# Altium project LEDMatrix.PrjPcb
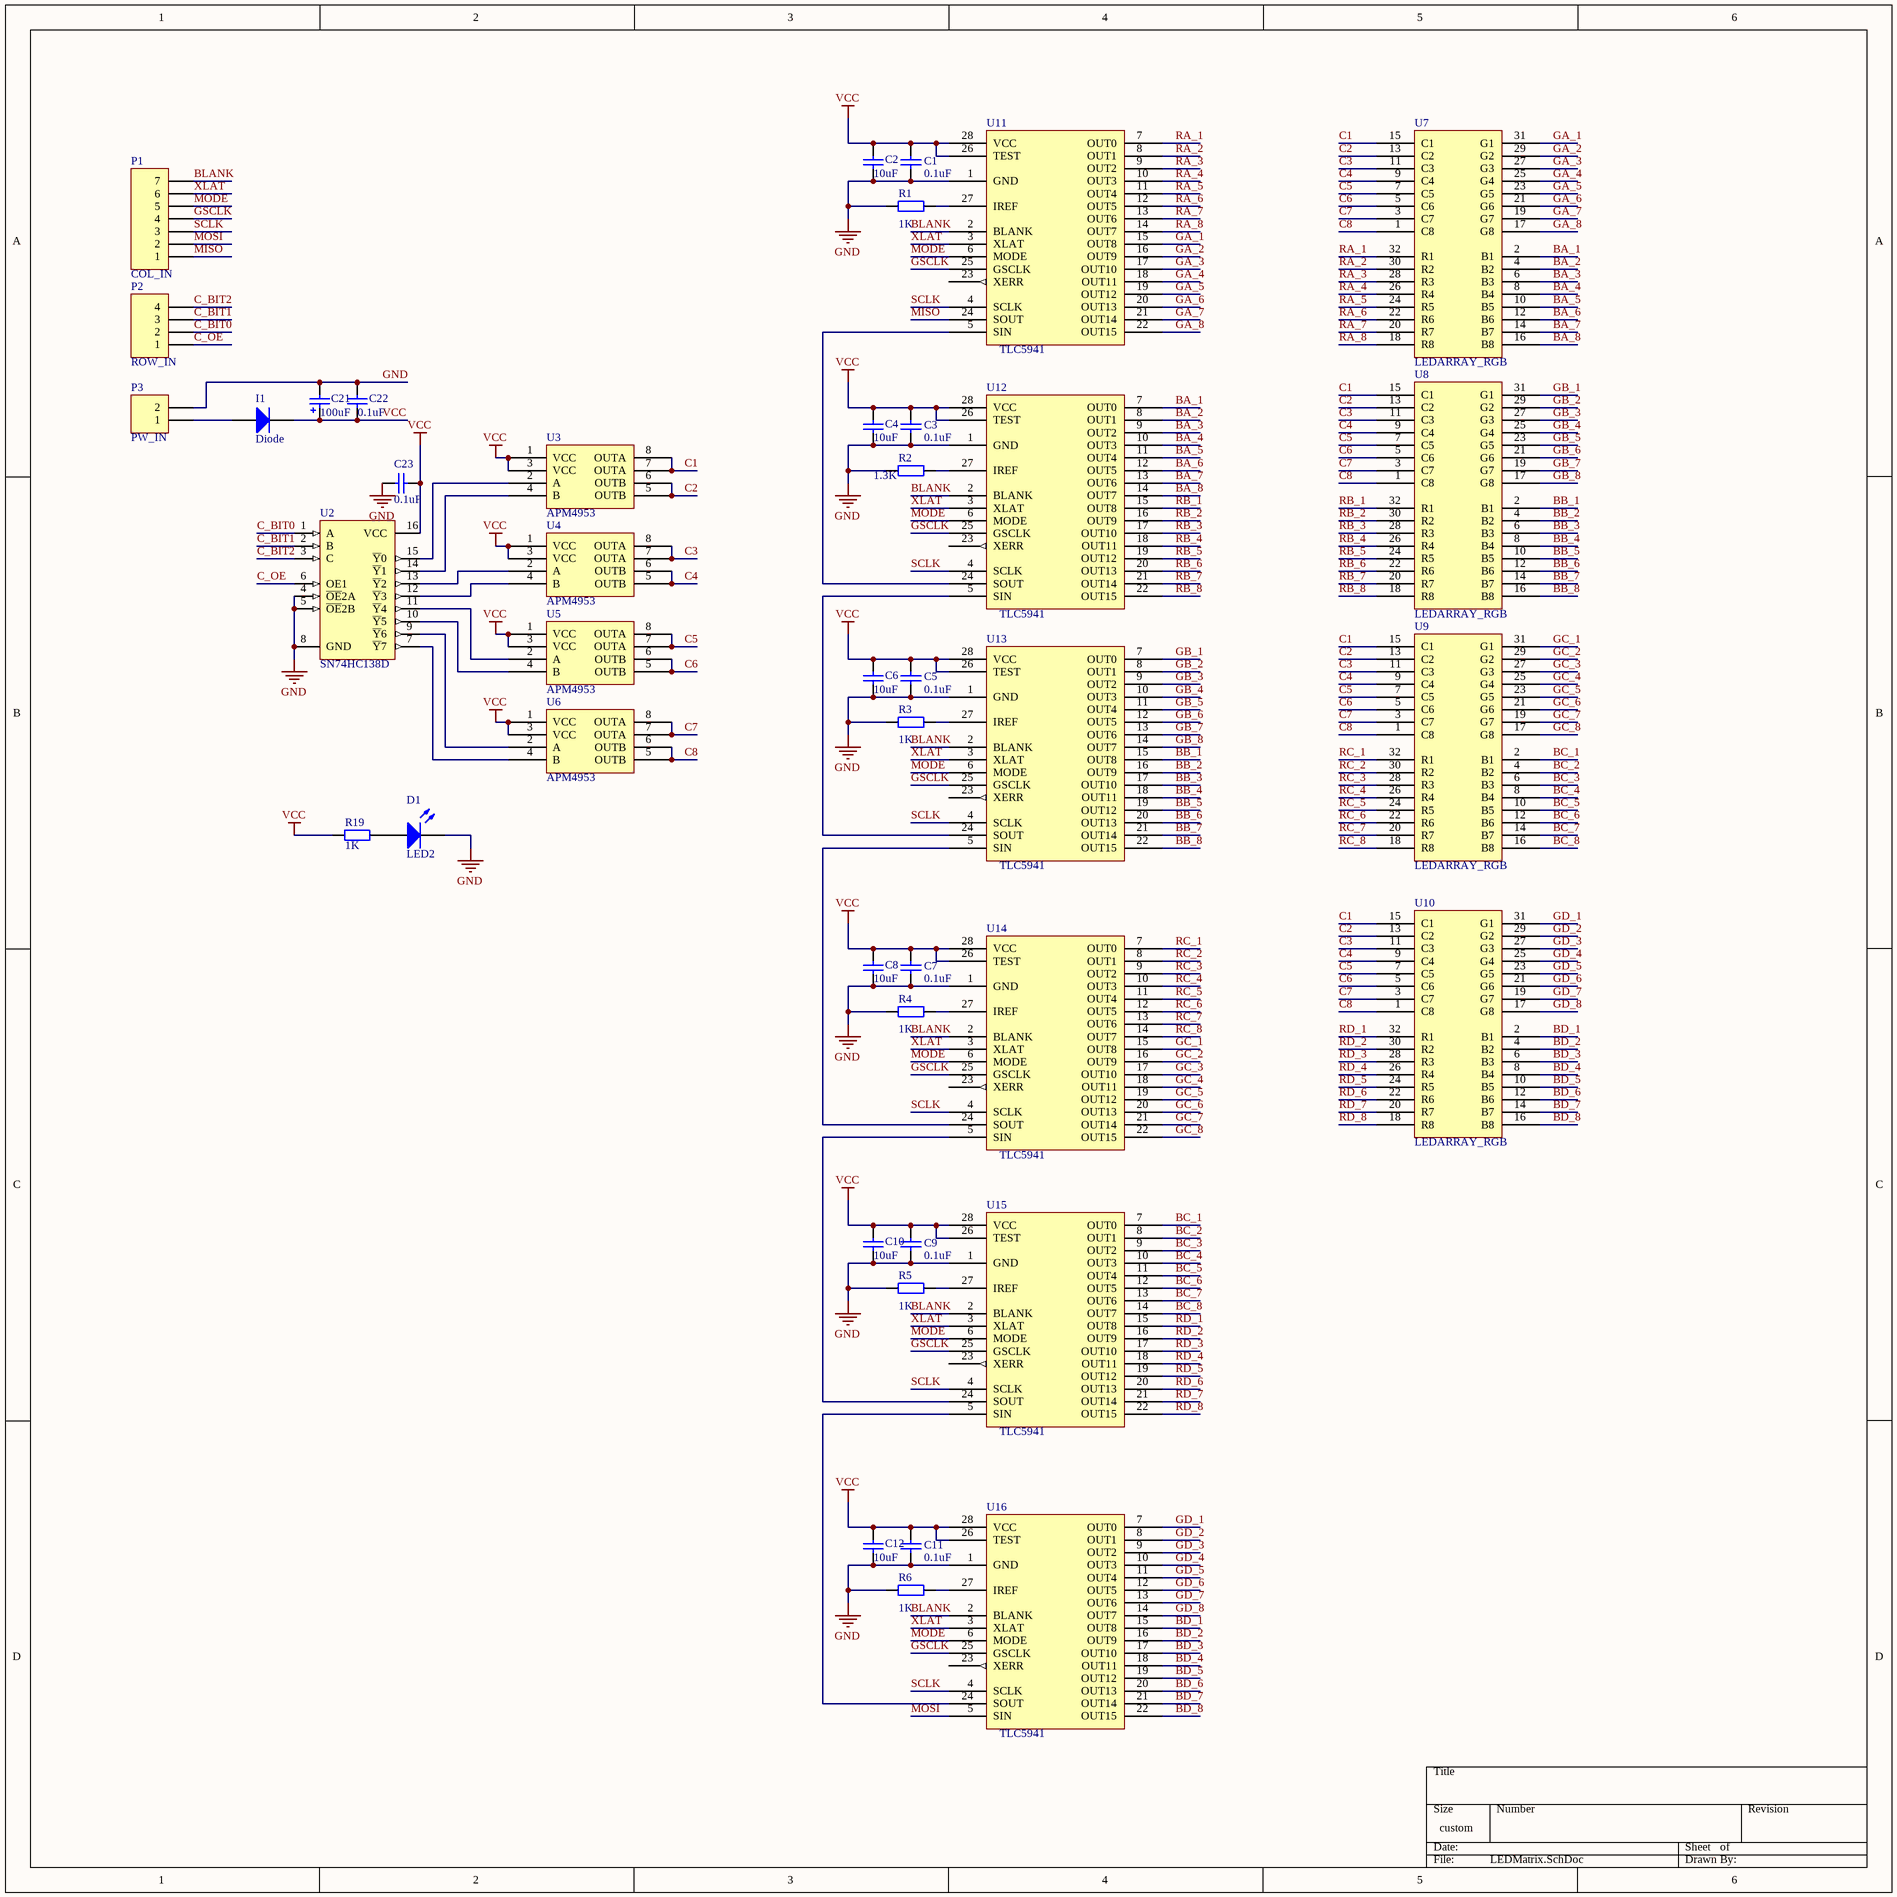
[diagram p0: LEDMatrix.SchDoc]
1 sheet, 42 parts. Net scope: global (net labels, ports and power ports of the same name join across sheets).
Board file: LEDMatrix.PcbDoc

## Sheet LEDMatrix.SchDoc
size 381 x 381 mm

### Parts
C1  value 0.1uF  [C-0805]  (hidden comment: Cap)
C2  value 10uF  [C-0805]  (hidden comment: Cap)
C3  value 0.1uF  [C-0805]  (hidden comment: Cap)
C4  value 10uF  [C-0805]  (hidden comment: Cap)
C5  value 0.1uF  [C-0805]  (hidden comment: Cap)
C6  value 10uF  [C-0805]  (hidden comment: Cap)
C7  value 0.1uF  [C-0805]  (hidden comment: Cap)
C8  value 10uF  [C-0805]  (hidden comment: Cap)
C9  value 0.1uF  [C-0805]  (hidden comment: Cap)
C10  value 10uF  [C-0805]  (hidden comment: Cap)
C11  value 0.1uF  [C-0805]  (hidden comment: Cap)
C12  value 10uF  [C-0805]  (hidden comment: Cap)
C21  value 100uF  [CAPAE-D]  (hidden comment: Cap Pol2)
C22  value 0.1uF  [C-0805]  (hidden comment: Cap)
C23  value 0.1uF  [C-0805]  (hidden comment: Cap)
D1  LED2  [LED-0805]
I1  Diode  [D-SMA]
P1  COL_IN  [HDR1X7]
P2  ROW_IN  [HDR1X4]
P3  PW_IN  [HDR1X2]
R1  value 1K  [0805-1]  (hidden comment: Res2)
R2  value 1.3K  [0805-1]  (hidden comment: Res2)
R3  value 1K  [0805-1]  (hidden comment: Res2)
R4  value 1K  [0805-1]  (hidden comment: Res2)
R5  value 1K  [0805-1]  (hidden comment: Res2)
R6  value 1K  [0805-1]  (hidden comment: Res2)
R19  value 1K  [0805-1]  (hidden comment: Res2)
U2  SN74HC138D  [SOIC-16]
U3  APM4953  [SOIC-8]
U4  APM4953  [SOIC-8]
U5  APM4953  [SOIC-8]
U6  APM4953  [SOIC-8]
U7  LEDARRAY_RGB  [DIP32]
U8  LEDARRAY_RGB  [DIP32]
U9  LEDARRAY_RGB  [DIP32]
U10  LEDARRAY_RGB  [DIP32]
U11  TLC5941  [TSOP28_N]
U12  TLC5941  [TSOP28_N]
U13  TLC5941  [TSOP28_N]
U14  TLC5941  [TSOP28_N]
U15  TLC5941  [TSOP28_N]
U16  TLC5941  [TSOP28_N]

### Nets
GND: C1.1 C2.1 C3.1 C4.1 C5.1 C6.1 C7.1 C8.1 C9.1 C10.1 C11.1 C12.1 C21.2 C22.2 C23.2 D1.2(K) P3.2 R1.1 R2.1 R3.1 R4.1 R5.1 R6.1 U2.4(~{OE}2A) U2.5(~{OE}2B) U2.8(GND) U11.1(GND) U12.1(GND) U13.1(GND) U14.1(GND) U15.1(GND) U16.1(GND)
VCC: C1.2 C2.2 C3.2 C4.2 C5.2 C6.2 C7.2 C8.2 C9.2 C10.2 C11.2 C12.2 C21.1 C22.1 C23.1 I1.2(K) R19.2 U2.16(VCC) U3.1(VCC) U3.3(VCC) U4.1(VCC) U4.3(VCC) U5.1(VCC) U5.3(VCC) U6.1(VCC) U6.3(VCC) U11.26(TEST) U11.28(VCC) U12.26(TEST) U12.28(VCC) U13.26(TEST) U13.28(VCC) U14.26(TEST) U14.28(VCC) U15.26(TEST) U15.28(VCC) U16.26(TEST) U16.28(VCC)
BA_1: U7.2(B1) U12.7(OUT0)
BA_2: U7.4(B2) U12.8(OUT1)
BA_3: U7.6(B3) U12.9(OUT2)
BA_4: U7.8(B4) U12.10(OUT3)
BA_5: U7.10(B5) U12.11(OUT4)
BA_6: U7.12(B6) U12.12(OUT5)
BA_7: U7.14(B7) U12.13(OUT6)
BA_8: U7.16(B8) U12.14(OUT7)
BB_1: U8.2(B1) U13.15(OUT8)
BB_2: U8.4(B2) U13.16(OUT9)
BB_3: U8.6(B3) U13.17(OUT10)
BB_4: U8.8(B4) U13.18(OUT11)
BB_5: U8.10(B5) U13.19(OUT12)
BB_6: U8.12(B6) U13.20(OUT13)
BB_7: U8.14(B7) U13.21(OUT14)
BB_8: U8.16(B8) U13.22(OUT15)
BC_1: U9.2(B1) U15.7(OUT0)
BC_2: U9.4(B2) U15.8(OUT1)
BC_3: U9.6(B3) U15.9(OUT2)
BC_4: U9.8(B4) U15.10(OUT3)
BC_5: U9.10(B5) U15.11(OUT4)
BC_6: U9.12(B6) U15.12(OUT5)
BC_7: U9.14(B7) U15.13(OUT6)
BC_8: U9.16(B8) U15.14(OUT7)
BD_1: U10.2(B1) U16.15(OUT8)
BD_2: U10.4(B2) U16.16(OUT9)
BD_3: U10.6(B3) U16.17(OUT10)
BD_4: U10.8(B4) U16.18(OUT11)
BD_5: U10.10(B5) U16.19(OUT12)
BD_6: U10.12(B6) U16.20(OUT13)
BD_7: U10.14(B7) U16.21(OUT14)
BD_8: U10.16(B8) U16.22(OUT15)
BLANK: P1.7 U11.2(BLANK) U12.2(BLANK) U13.2(BLANK) U14.2(BLANK) U15.2(BLANK) U16.2(BLANK)
C1: U3.7(OUTA) U3.8(OUTA) U7.15(C1) U8.15(C1) U9.15(C1) U10.15(C1)
C2: U3.5(OUTB) U3.6(OUTB) U7.13(C2) U8.13(C2) U9.13(C2) U10.13(C2)
C3: U4.7(OUTA) U4.8(OUTA) U7.11(C3) U8.11(C3) U9.11(C3) U10.11(C3)
C4: U4.5(OUTB) U4.6(OUTB) U7.9(C4) U8.9(C4) U9.9(C4) U10.9(C4)
C5: U5.7(OUTA) U5.8(OUTA) U7.7(C5) U8.7(C5) U9.7(C5) U10.7(C5)
C6: U5.5(OUTB) U5.6(OUTB) U7.5(C6) U8.5(C6) U9.5(C6) U10.5(C6)
C7: U6.7(OUTA) U6.8(OUTA) U7.3(C7) U8.3(C7) U9.3(C7) U10.3(C7)
C8: U6.5(OUTB) U6.6(OUTB) U7.1(C8) U8.1(C8) U9.1(C8) U10.1(C8)
C_BIT0: P2.2 U2.1(A)
C_BIT1: P2.3 U2.2(B)
C_BIT2: P2.4 U2.3(C)
C_OE: P2.1 U2.6(OE1)
GA_1: U7.31(G1) U11.15(OUT8)
GA_2: U7.29(G2) U11.16(OUT9)
GA_3: U7.27(G3) U11.17(OUT10)
GA_4: U7.25(G4) U11.18(OUT11)
GA_5: U7.23(G5) U11.19(OUT12)
GA_6: U7.21(G6) U11.20(OUT13)
GA_7: U7.19(G7) U11.21(OUT14)
GA_8: U7.17(G8) U11.22(OUT15)
GB_1: U8.31(G1) U13.7(OUT0)
GB_2: U8.29(G2) U13.8(OUT1)
GB_3: U8.27(G3) U13.9(OUT2)
GB_4: U8.25(G4) U13.10(OUT3)
GB_5: U8.23(G5) U13.11(OUT4)
GB_6: U8.21(G6) U13.12(OUT5)
GB_7: U8.19(G7) U13.13(OUT6)
GB_8: U8.17(G8) U13.14(OUT7)
GC_1: U9.31(G1) U14.15(OUT8)
GC_2: U9.29(G2) U14.16(OUT9)
GC_3: U9.27(G3) U14.17(OUT10)
GC_4: U9.25(G4) U14.18(OUT11)
GC_5: U9.23(G5) U14.19(OUT12)
GC_6: U9.21(G6) U14.20(OUT13)
GC_7: U9.19(G7) U14.21(OUT14)
GC_8: U9.17(G8) U14.22(OUT15)
GD_1: U10.31(G1) U16.7(OUT0)
GD_2: U10.29(G2) U16.8(OUT1)
GD_3: U10.27(G3) U16.9(OUT2)
GD_4: U10.25(G4) U16.10(OUT3)
GD_5: U10.23(G5) U16.11(OUT4)
GD_6: U10.21(G6) U16.12(OUT5)
GD_7: U10.19(G7) U16.13(OUT6)
GD_8: U10.17(G8) U16.14(OUT7)
GSCLK: P1.4 U11.25(GSCLK) U12.25(GSCLK) U13.25(GSCLK) U14.25(GSCLK) U15.25(GSCLK) U16.25(GSCLK)
MISO: P1.1 U11.24(SOUT)
MODE: P1.5 U11.6(MODE) U12.6(MODE) U13.6(MODE) U14.6(MODE) U15.6(MODE) U16.6(MODE)
MOSI: P1.2 U16.5(SIN)
RA_1: U7.32(R1) U11.7(OUT0)
RA_2: U7.30(R2) U11.8(OUT1)
RA_3: U7.28(R3) U11.9(OUT2)
RA_4: U7.26(R4) U11.10(OUT3)
RA_5: U7.24(R5) U11.11(OUT4)
RA_6: U7.22(R6) U11.12(OUT5)
RA_7: U7.20(R7) U11.13(OUT6)
RA_8: U7.18(R8) U11.14(OUT7)
RB_1: U8.32(R1) U12.15(OUT8)
RB_2: U8.30(R2) U12.16(OUT9)
RB_3: U8.28(R3) U12.17(OUT10)
RB_4: U8.26(R4) U12.18(OUT11)
RB_5: U8.24(R5) U12.19(OUT12)
RB_6: U8.22(R6) U12.20(OUT13)
RB_7: U8.20(R7) U12.21(OUT14)
RB_8: U8.18(R8) U12.22(OUT15)
RC_1: U9.32(R1) U14.7(OUT0)
RC_2: U9.30(R2) U14.8(OUT1)
RC_3: U9.28(R3) U14.9(OUT2)
RC_4: U9.26(R4) U14.10(OUT3)
RC_5: U9.24(R5) U14.11(OUT4)
RC_6: U9.22(R6) U14.12(OUT5)
RC_7: U9.20(R7) U14.13(OUT6)
RC_8: U9.18(R8) U14.14(OUT7)
RD_1: U10.32(R1) U15.15(OUT8)
RD_2: U10.30(R2) U15.16(OUT9)
RD_3: U10.28(R3) U15.17(OUT10)
RD_4: U10.26(R4) U15.18(OUT11)
RD_5: U10.24(R5) U15.19(OUT12)
RD_6: U10.22(R6) U15.20(OUT13)
RD_7: U10.20(R7) U15.21(OUT14)
RD_8: U10.18(R8) U15.22(OUT15)
SCLK: P1.3 U11.4(SCLK) U12.4(SCLK) U13.4(SCLK) U14.4(SCLK) U15.4(SCLK) U16.4(SCLK)
XLAT: P1.6 U11.3(XLAT) U12.3(XLAT) U13.3(XLAT) U14.3(XLAT) U15.3(XLAT) U16.3(XLAT)
NetD1_1: D1.1(A) R19.1
NetI1_1: I1.1(A) P3.1
NetR1_2: R1.2 U11.27(IREF)
NetR2_2: R2.2 U12.27(IREF)
NetR3_2: R3.2 U13.27(IREF)
NetR4_2: R4.2 U14.27(IREF)
NetR5_2: R5.2 U15.27(IREF)
NetR6_2: R6.2 U16.27(IREF)
NetU2_7: U2.7(~{Y}7) U6.4(B)
NetU2_9: U2.9(~{Y}6) U6.2(A)
NetU2_10: U2.10(~{Y}5) U5.4(B)
NetU2_11: U2.11(~{Y}4) U5.2(A)
NetU2_12: U2.12(~{Y}3) U4.4(B)
NetU2_13: U2.13(~{Y}2) U4.2(A)
NetU2_14: U2.14(~{Y}1) U3.4(B)
NetU2_15: U2.15(~{Y}0) U3.2(A)
NetU11_5: U11.5(SIN) U12.24(SOUT)
NetU12_5: U12.5(SIN) U13.24(SOUT)
NetU13_5: U13.5(SIN) U14.24(SOUT)
NetU14_5: U14.5(SIN) U15.24(SOUT)
NetU15_5: U15.5(SIN) U16.24(SOUT)

Not connected (* = marked no-connect by the designer): U11 23(XERR) 29(GND); U12 23(XERR) 29(GND); U13 23(XERR) 29(GND); U14 23(XERR) 29(GND); U15 23(XERR) 29(GND); U16 23(XERR) 29(GND)

### Library data of the parts
C1-C12 C22 C23 = Cap: Capacitor; Published: 8-Jun-2000; LatestRevisionDate: 17-Jul-2002; LatestRevisionNote: Re-released for DXP Platform.; PackageReference: RAD-0.3; Publisher: Altium Limited; PackageDescription: Radial Cap, Thru-Hole; 2 Leads; 0.3 in Pin Spacing
C21 = Cap Pol2: Polarized Capacitor (Axial); Published: 8-Jun-2000; LatestRevisionDate: 17-Jul-2002; LatestRevisionNote: Re-released for DXP Platform.; PackageReference: POLAR0.8; Publisher: Altium Limited; PackageDescription: Polarized Capacitor; 2 Leads
D1 = LED2: Typical RED, GREEN, YELLOW, AMBER GaAs LED; Published: 8-Jun-2000; LatestRevisionDate: 17-Jul-2002; LatestRevisionNote: Re-released for DXP Platform.; PackageVersion: Feb-2002; PackageReference: 3.2X1.6X1.1; Publisher: Altium Limited; PackageDescription: SM LED; 2 Flat Leads
I1 = Diode: Default Diode; Published: 8-Jun-2000; LatestRevisionDate: 17-Jul-2002; LatestRevisionNote: Re-released for DXP Platform.; PackageVersion: Sep-1996; PackageReference: SMC; Publisher: Altium Limited; PackageDescription: DO-214-AB/SMC; 2 C-Bend Leads; Body 7.9 x 5.9 mm, inc. leads (LxW); Code_JEDEC: DO-214-AB
P1 = Header 7: Header, 7-Pin; LatestRevisionDate: 17-Jul-2002; LatestRevisionNote: Re-released for DXP Platform.; Publisher: Altium Limited
P2 = Header 4: Header, 4-Pin; LatestRevisionDate: 17-Jul-2002; LatestRevisionNote: Re-released for DXP Platform.; Publisher: Altium Limited
P3 = Header 2: Header, 2-Pin; LatestRevisionDate: 17-Jul-2002; LatestRevisionNote: Re-released for DXP Platform.; Publisher: Altium Limited
R1-R6 R19 = Res2: Resistor; Published: 8-Jun-2000; LatestRevisionDate: 17-Jul-2002; LatestRevisionNote: Re-released for DXP Platform.; PackageReference: AXIAL-0.4; Publisher: Altium Limited; PackageDescription: Axial Device, Thru-Hole; 2 Leads; 0.4 in Pin Spacing
U2 = SN74HC138D: 3-Line to 8-Line Decoder / Demultiplexer; Published: 8-Jun-2000; LatestRevisionDate: 13-Apr-2006; LatestRevisionNote: IPC-7351 Footprint Added.; DatasheetVersion: May-1997; PackageVersion: Jan-1998; PackageReference: D016; Publisher: Altium Limited; PackageDescription: 16-Pin Small Outline Integrated Circuit 1.27 mm Pitch; Code_IPC: SOIC127P600-16; ComponentLink1Description: Manufacturer Link; ComponentLink1URL: http://www.ti.com/; ComponentLink2Description: Datasheet; ComponentLink2URL: http://www-s.ti.com/sc/ds/sn74hc138.pdf